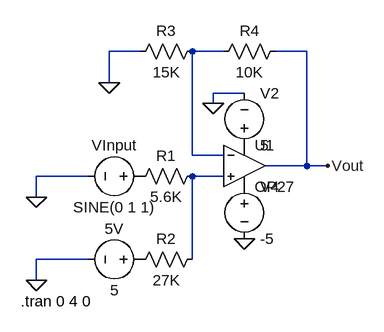
[diagram p0: schematic Simple Level Shifter.asc]
Simple Level Shifter.asc, the LTspice schematic file:
Version 4
SHEET 1 880 680
WIRE 32 0 -16 0
WIRE 160 0 112 0
WIRE 288 0 240 0
WIRE -16 48 -16 0
WIRE 192 64 144 64
WIRE 144 80 144 64
WIRE 112 160 112 0
WIRE 160 160 112 160
WIRE 288 176 288 0
WIRE 288 176 224 176
WIRE 320 176 288 176
WIRE -48 192 -128 192
WIRE 160 192 112 192
WIRE -128 224 -128 192
WIRE -48 320 -128 320
WIRE 112 320 112 192
WIRE -128 352 -128 320
FLAG -16 48 0
FLAG 144 80 0
FLAG 192 288 0
FLAG -128 224 0
FLAG -128 352 0
FLAG 320 176 Vout
SYMBOL res 128 176 R90
WINDOW 0 0 56 VBottom 2
WINDOW 3 32 56 VTop 2
SYMATTR InstName R1
SYMATTR Value 5.6K
SYMBOL res 256 -16 R90
WINDOW 0 0 56 VBottom 2
WINDOW 3 32 56 VTop 2
SYMATTR InstName R4
SYMATTR Value 10K
SYMBOL res 128 -16 R90
WINDOW 0 0 56 VBottom 2
WINDOW 3 32 56 VTop 2
SYMATTR InstName R3
SYMATTR Value 15K
SYMBOL res 128 304 R90
WINDOW 0 0 56 VBottom 2
WINDOW 3 32 56 VTop 2
SYMATTR InstName R2
SYMATTR Value 27K
SYMBOL voltage 48 320 R90
WINDOW 0 -32 56 VBottom 2
WINDOW 3 32 56 VTop 2
SYMATTR InstName 5V
SYMATTR Value 5
SYMBOL voltage 192 192 R0
WINDOW 123 0 0 Left 0
WINDOW 39 0 0 Left 0
SYMATTR InstName V4
SYMATTR Value -5
SYMBOL OpAmps\\OP27 192 112 R0
SYMATTR InstName U1
SYMBOL voltage 48 192 R90
WINDOW 0 -32 56 VBottom 2
WINDOW 3 32 56 VTop 2
SYMATTR InstName VInput
SYMATTR Value SINE(0 1 1)
SYMBOL voltage 192 160 M180
WINDOW 0 24 96 Left 2
WINDOW 3 24 16 Left 2
WINDOW 123 0 0 Left 0
WINDOW 39 0 0 Left 0
SYMATTR InstName V2
SYMATTR Value 5
TEXT -152 384 Left 2 !.tran 0 4 0

The netlist it stands for:
* Simple Level Shifter.asc
R1 N002 P001 5.6K
R4 Vout N001 10K
R3 N001 0 15K
R2 N002 P002 27K
V§5V P002 0 5
V4 P003 0 -5
XU1 N002 N001 P004 P003 Vout OP27  ; pins In+ In- V+ V- OUT
VInput P001 0 SINE(0 1 1)
V2 P004 0 5
.tran 0 4 0
.lib ADI.lib
.backanno
.end